# EAGLE design Escorna_CPU_2_10 (EAGLE 6.4)
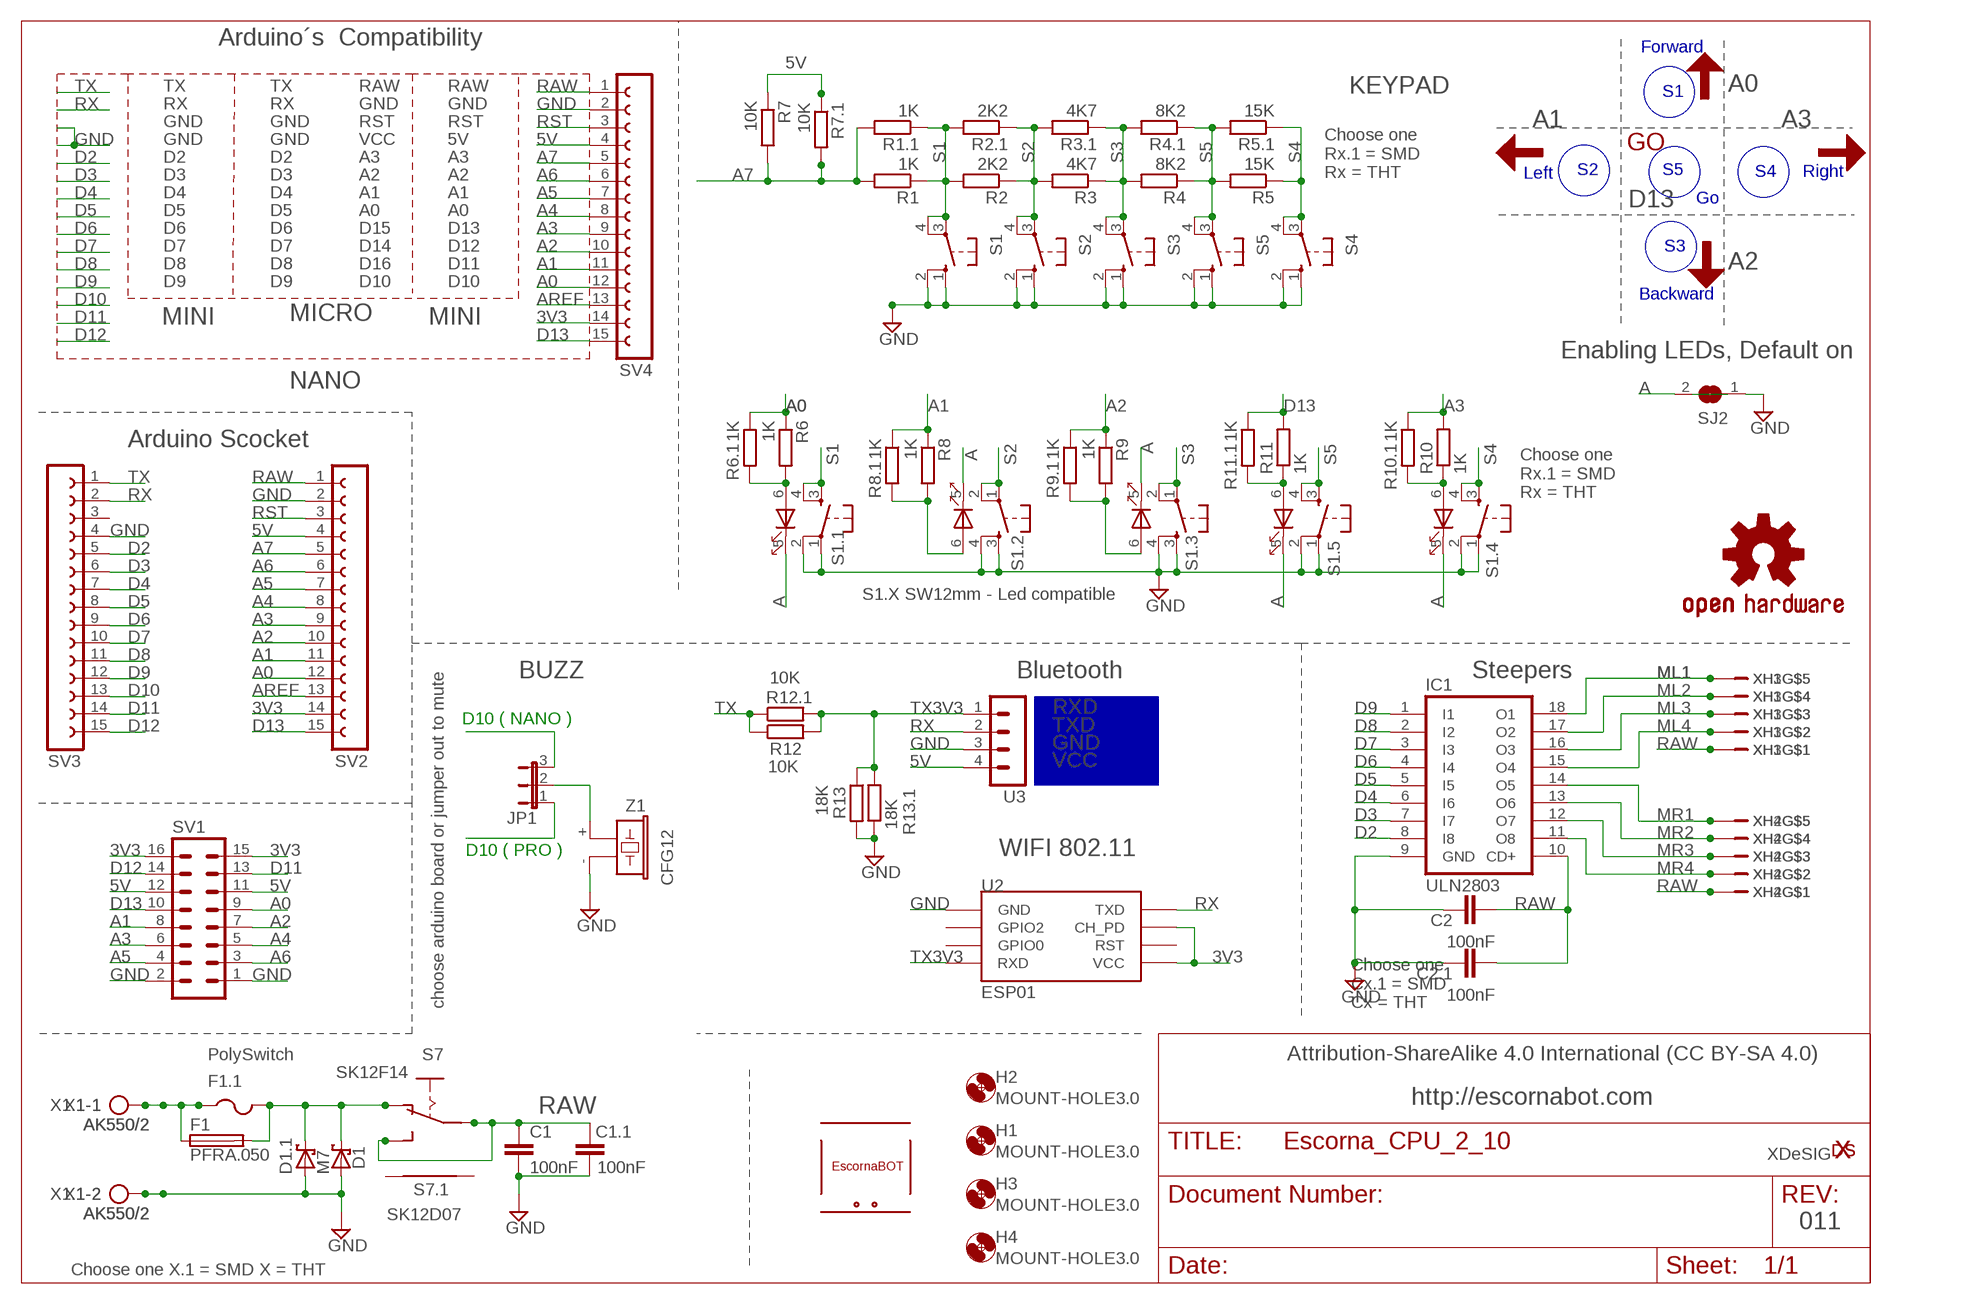
[diagram p0: schematic, sheet 1]

## Parts
C1  100nF  C-EU025-025X050  [C025-025X050]
C1.1  100nF  C-EUC1206  [C1206]
C2  100nF  C-EU025-025X050  [C025-025X050]
C2.1  100nF  C-EUC1206  [C1206]
D1  1N5817  P4KEXX  [DO41-10]
D1.1  M7  SCHOTTKY-DIODESMA  [SMA]
ESC  ESCORNABOT  [ESCORNA_PEQUE]
F1  PFRA.050  FUSETE5  [TE5]
F1.1  PolySwitch  PTCFUSE-1206  [R1206]
H1  MOUNT-HOLE3.0  [3,0]
H2  MOUNT-HOLE3.0  [3,0]
H3  MOUNT-HOLE3.0  [3,0]
H4  MOUNT-HOLE3.0  [3,0]
IC1  ULN2803  ULN2803A  [DIL18]
JP1  JUMPER_JP2E  [JUMPER_JP2]
LOGO2  OSHW-LOGOS  [OSHW-LOGO-S]
R1  1K  R-EU_0204/7  [0204/7]
R1.1  1K  R-EU_R0603  [R0603]
R2  2K2  R-EU_0204/7  [0204/7]
R2.1  2K2  R-EU_R0603  [R0603]
R3  4K7  R-EU_0204/7  [0204/7]
R3.1  4K7  R-EU_R0603  [R0603]
R4  8K2  R-EU_0204/7  [0204/7]
R4.1  8K2  R-EU_R0603  [R0603]
R5  15K  R-EU_0204/7  [0204/7]
R5.1  15K  R-EU_R0603  [R0603]
R6  1K  R-EU_0204/7  [0204/7]
R6.1  1K  R-EU_R0603  [R0603]
R7  10K  R-EU_0204/7  [0204/7]
R7.1  10K  R-EU_R0603  [R0603]
R8  1K  R-EU_0204/7  [0204/7]
R8.1  1K  R-EU_R0603  [R0603]
R9  1K  R-EU_0204/7  [0204/7]
R9.1  1K  R-EU_R0603  [R0603]
R10  1K  R-EU_0204/7  [0204/7]
R10.1  1K  R-EU_R0603  [R0603]
R11  1K  R-EU_0204/7  [0204/7]
R11.1  1K  R-EU_R0603  [R0603]
R12  10K  R-EU_0204/7  [0204/7]
R12.1  10K  R-EU_R0603  [R0603]
R13  18K  R-EU_0204/7  [0204/7]
R13.1  18K  R-EU_R0603  [R0603]
S1  10-XX  [B3F-10XX]
S1.1  B3F-9XXX  SWITCH-OMRON_B3F-9XXX  [B3F-9XXX]
S1.2  B3F-9XXX  SWITCH-OMRON_B3F-9XXX  [B3F-9XXX]
S1.3  B3F-9XXX  SWITCH-OMRON_B3F-9XXX  [B3F-9XXX]
S1.4  B3F-9XXX  SWITCH-OMRON_B3F-9XXX  [B3F-9XXX]
S1.5  B3F-9XXX  SWITCH-OMRON_B3F-9XXX  [B3F-9XXX]
S2  10-XX  [B3F-10XX]
S3  10-XX  [B3F-10XX]
S4  10-XX  [B3F-10XX]
S5  10-XX  [B3F-10XX]
S7  SK12F14  ESCORNA_SK12F14F  [ESCORNA_SK-12F14-G]
S7.1  SK12D07  ESCORNA_SK12F14D  [ESCORNA_SK-12D07]
SJ2  SJ  [SJ]
SV1  MA08-2  [MA08-2]
SV2  CON-LSTA_FE15-1  [CON-LSTA_FE15]
SV3  CON-LSTA_FE15-1  [CON-LSTA_FE15]
SV4  CON-LSTA_FE15-1  [CON-LSTA_FE15]
U2  ESP01  [ESP01]
U3  MA04-1  [MA04-1]
U$1  FRECHA  [FRECHA]
U$2  GO  [VALE]
U$3  FRECHA  [FRECHA]
U$6  FRECHA  [FRECHA]
U$11  FRECHA  [FRECHA]
U$13  XDESIG_XDESIG21  [XDESIG_XDESIG]
X1  AK550/2  [AK550/2]
X1.1  AK550/2  [AK550/2]
XDS1  XDESIG  [XDESIG_CU_2]
XH1  B5B-XH-A  [B5B-XH-A]
XH2  B5B-XH-A  [B5B-XH-A]
XH3  B5B-XH-A  [B5B-XH-A]
XH4  B5B-XH-A  [B5B-XH-A]
Z1  CFG12  F/CM12P  [F/CM12P]

## Nets
3V3: SV1.15 SV1.16 SV2.14 SV4.14 U2.CH_PD U2.VCC
5V: R7.1 R7.1.1 SV1.11 SV1.12 SV2.4 SV4.4 U3.4
A: S1.1.5(K) S1.2.5(K) S1.3.5(K) S1.4.5(K) S1.5.5(K) SJ2.2
A0: JP1.1 R6.1 R6.1.1 SV1.9 SV2.12 SV4.12
A1: R8.1 R8.1.1 SV1.8 SV2.11 SV4.11
A2: R9.1 R9.1.1 SV1.7 SV2.10 SV4.10
A3: R10.1.1 R10.2 SV1.6 SV2.9 SV4.9
A4: SV1.5 SV2.8 SV4.8
A5: SV1.4 SV2.7 SV4.7
A6: SV1.3 SV2.6 SV4.6
A7: R1.1.2 R1.2 R7.1.2 R7.2 SV2.5 SV4.5
AREF: SV2.13 SV4.13
D2: IC1.8(I8) SV3.5
D3: IC1.7(I7) SV3.6
D4: IC1.6(I6) SV3.7
D5: IC1.5(I5) SV3.8
D6: IC1.4(I4) SV3.9
D7: IC1.3(I3) SV3.10
D8: IC1.2(I2) SV3.11
D9: IC1.1(I1) SV3.12
D10: JP1.3 SV3.13
D11: SV1.13 SV3.14
D12: SV1.14 SV3.15
D13: R11.1.1 R11.2 SV1.10 SV2.15 SV4.15
GND: C1.1.1 C1.2 C2.1 C2.1.1 D1.1.A D1.A IC1.9(GND) R13.1.1 R13.2 S1.1(S) S1.1.1(P) S1.1.2(P1) S1.2(S1) S1.2.3(S) S1.2.4(S1) S1.3.3(S) S1.3.4(S1) S1.4.1(P) S1.4.2(P1) S1.5.1(P) S1.5.2(P1) S2.1(S) S2.2(S1) S3.1(S) S3.2(S1) S4.1(S) S4.2(S1) S5.1(S) S5.2(S1) SJ2.1 SV1.1 SV1.2 SV2.2 SV3.4 SV4.2 U2.GND U3.3 X1.1.2 X1.2 Z1.-
ML1: IC1.18(O1) XH1.P$5 XH3.P$5
ML2: IC1.17(O2) XH1.P$4 XH3.P$4
ML3: IC1.16(O3) XH1.P$3 XH3.P$3
ML4: IC1.15(O4) XH1.P$2 XH3.P$2
MR1: IC1.14(O5) XH2.P$5 XH4.P$5
MR2: IC1.13(O6) XH2.P$4 XH4.P$4
MR3: IC1.12(O7) XH2.P$3 XH4.P$3
MR4: IC1.11(O8) XH2.P$2 XH4.P$2
N$2: JP1.2 Z1.+
N$3: D1.1.C D1.C F1.1.2 F1.2 S7.1.P$2(O) S7.P$2(O)
N$4: R8.1.2 R8.2 S1.2.6(A)
N$5: R6.1.2 R6.2 S1.1.6(A)
N$6: R9.1.2 R9.2 S1.3.6(A)
N$8: R10.1 R10.1.2 S1.4.6(A)
N$10: S7.1.P$4 S7.P$4
N$11: S7.1.P$5 S7.P$5
N$12: F1.1 F1.1.1 X1.1 X1.1.1
N$13: R11.1 R11.1.2 S1.5.6(A)
RAW: C1.1 C1.1.2 C2.1.2 C2.2 IC1.10(CD+) S7.1.P$1(P) S7.1.P$3(S) S7.P$1(P) S7.P$3(S) SV2.1 SV4.1 XH1.P$1 XH2.P$1 XH3.P$1 XH4.P$1
RST: SV2.3 SV4.3
RX: SV3.2 U2.TX(TXD) U3.2
S1: R1.1 R1.1.1 R2.1.2 R2.2 S1.1.3(S) S1.1.4(S1) S1.3(P) S1.4(P1)
S2: R2.1 R2.1.1 R3.1.2 R3.2 S1.2.1(P) S1.2.2(P1) S2.3(P) S2.4(P1)
S3: R3.1 R3.1.1 R4.1.2 R4.2 S1.3.1(P) S1.3.2(P1) S3.3(P) S3.4(P1)
S4: R5.1 R5.1.1 S1.4.3(S) S1.4.4(S1) S4.3(P) S4.4(P1)
S5: R4.1 R4.1.1 R5.1.2 R5.2 S1.5.3(S) S1.5.4(S1) S5.3(P) S5.4(P1)
TX: R12.1 R12.1.1 SV3.1
TX3V3: R12.1.2 R12.2 R13.1 R13.1.2 U2.RX(RXD) U3.1
Unconnected: SV3.3 U2.GPIO0 U2.GPIO2 U2.RST

## Notes on the sheet
- Arduino´s  Compatibility
- Forward
- TX | TX | RAW | RAW | KEYPAD | A0
- S1
- RX | RX | GND | GND
- GND | GND | RST | RST | A1 | A3
- GND | GND | VCC | 5V
- D2 | D2 | A3 | A3
- Left | S2 | S5 | S4 | Right
- D3 | D3 | A2 | A2
- Choose one
  Rx.1 = SMD
  Rx = THT
- D4 | D4 | A1 | A1
- D13 | Go
- D5 | D5 | A0 | A0
- D6 | D6 | D15 | D13
- D7 | D7 | D14 | D12 | S3
- D8 | D8 | D16 | D11 | A2
- D9 | D9 | D10 | D10
- Backward
- MINI | MINI
- MICRO
- Enabling LEDs, Default on
- NANO
- Arduino Scocket
- Choose one
  Rx.1 = SMD
  Rx = THT
- S1.X SW12mm - Led compatible
- choose arduino board or jumper out to mute
- BUZZ | Bluetooth | Steepers
- RXD
- D10 ( NANO )
- TXD
- GND
- VCC
- D10 ( PRO ) | WIFI 802.11
- Choose one
  Cx.1 = SMD
  Cx = THT
- Attribution-ShareAlike 4.0 International (CC BY-SA 4.0)
- http://escornabot.com
- XDeSIG
- 011
- Choose one X.1 = SMD X = THT

## Library data of the parts
C1 C1.1 C2 C2.1 = rcl:C-EU: CAPACITOR, European symbol
D1 = diode:P4KEXX: DIODE transient-voltage suppressor
D1.1 = diode:SCHOTTKY-DIODE: Schottky Diode
ESC = escorna:ESCORNABOT
F1 = fuse:FUSE: Fuse; OC_FARNELL: unknown; OC_NEWARK: unknown
F1.1 = adafruit:PTCFUSE: PTC fuses, resettable thermistors
H1-H4 = holes:MOUNT-HOLE: MOUNTING HOLE with drill center marker
IC1 = uln-udn:ULN2803A: DRIVER ARRAY
JP1 = escorna_LBREscorna_CPU_2_10:JUMPER_JP2E: JUMPER
LOGO2 = SparkFun-Aesthetics:OSHW-LOGO: Open Source Hardware Logo This logo indicates the piece of hardware it is found on incorporates a OSHW license and/or adheres to the definition of open source hardware found here: http://freedomdefined.org/OSHW
R1 R1.1 R2 R2.1 R3 R3.1 R4 R4.1 R5 R5.1 R6 R6.1 R7 R7.1 R8 R8.1 R9 R9.1 R10 R10.1 R11 R11.1 R12 R12.1 R13 R13.1 = rcl:R-EU_: RESISTOR, European symbol
S1-S5 = switch-omron:10-XX: OMRON SWITCH; MPN: B3F-1000; OC_FARNELL: 176432; OC_NEWARK: 36M3542
S1.1-S1.5 = Escorna_CPU_2_01:SWITCH-OMRON_B3F-9XXX
S7 S7.1 = escorna_ELIB:ESCORNA_SK12F14
SJ2 = jumper:SJ: SMD solder JUMPER
SV1 = con-lstb:MA08-2: PIN HEADER; OC_FARNELL: unknown; OC_NEWARK: unknown
SV2-SV4 = escorna_LBREscorna_CPU_2_10:CON-LSTA_FE15-1: FEMALE HEADER; OC_FARNELL: unknown; OC_NEWARK: unknown
U2 = esp8266modules:ESP01: ESP8266 Wifi module 01
U3 = con-lstb:MA04-1: PIN HEADER; OC_FARNELL: unknown; OC_NEWARK: unknown
U$1 U$3 U$6 U$11 = escorna:FRECHA
U$2 = escorna:GO
U$13 = Escorna_CPU_2_01:XDESIG_XDESIG
X1 X1.1 = con-ptr500:AK550/2: CONNECTOR; OC_FARNELL: unknown; OC_NEWARK: unknown
XDS1 = xdesig:XDESIG
XH1-XH4 = con-jst:B5B-XH-A
Z1 = buzzer:F/CM12P: BUZZER Source: Buerklin; OC_FARNELL: unknown; OC_NEWARK: unknown

## Net classes
0 default: width 0.254 mm, drill 0.61 mm, clearance 0.254 mm
1 power: width 0.254 mm, drill 0.61 mm, clearance 0.254 mm

## Board
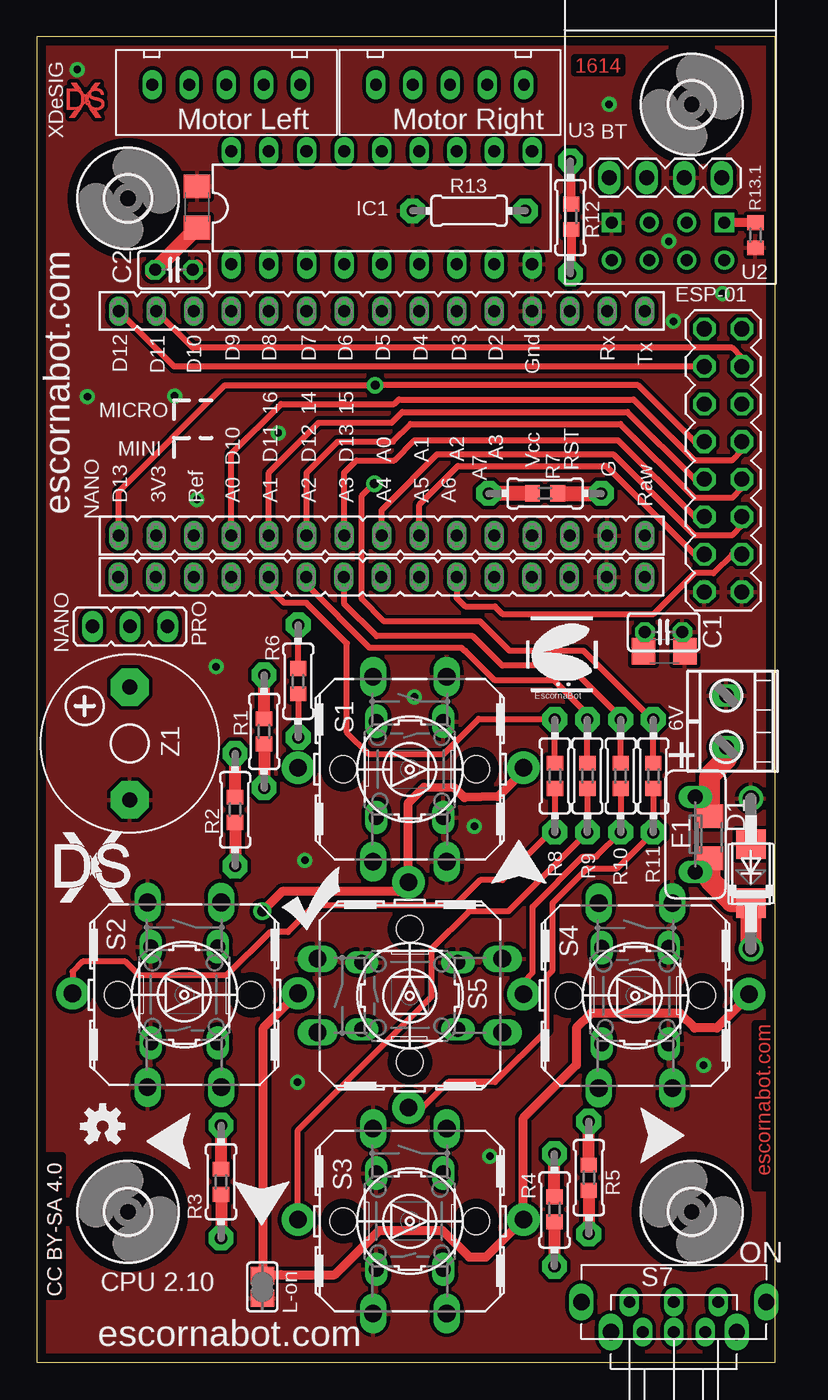
[diagram p1: board, top side]
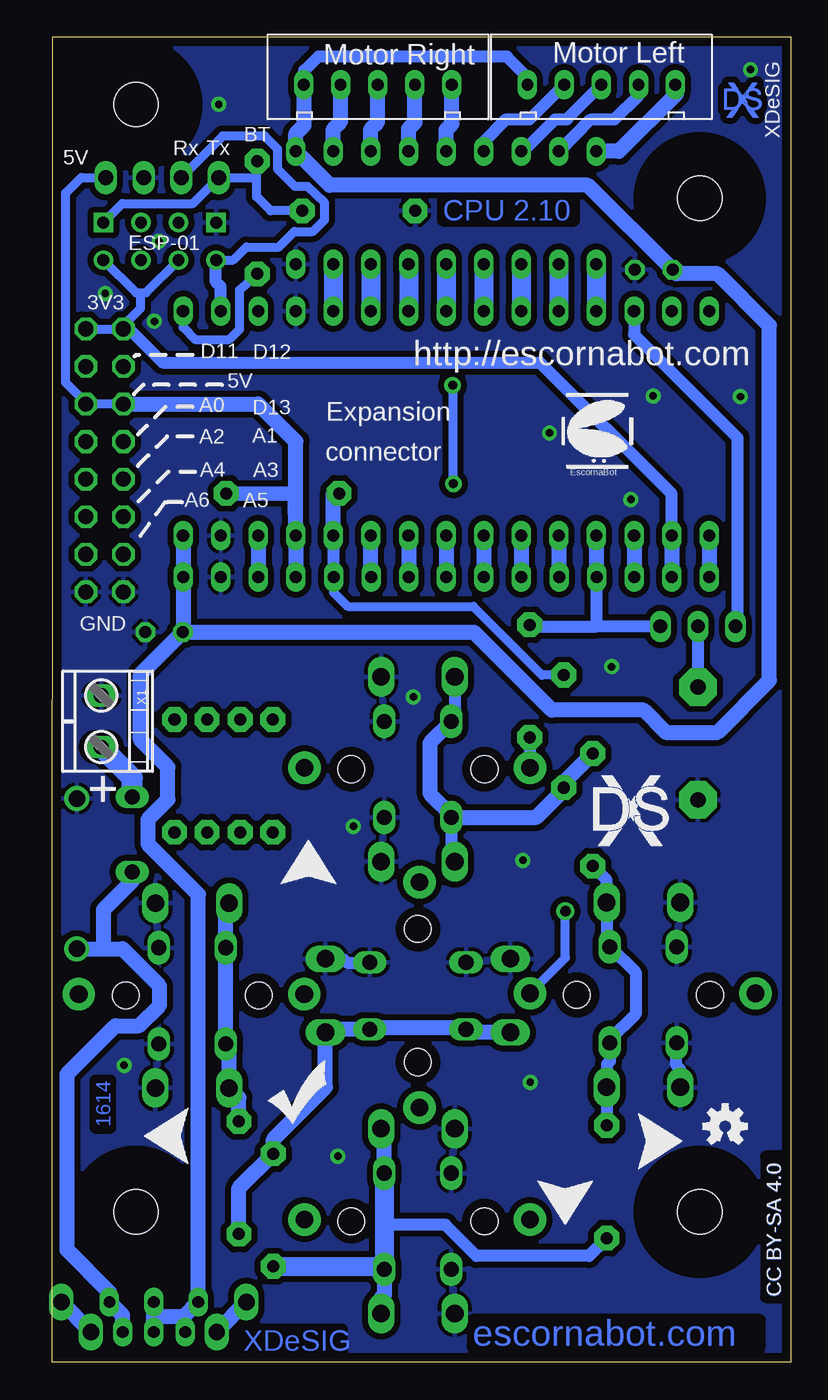
[diagram p2: board, bottom side, seen from below]

Size 49.91 x 89.59 mm. Coordinates in mm from the lower left corner, seen from the top.
Outline: 49.91,0 49.89,89.59 0,89.59 0,0 49.91,0
Copper layers (1*16): Top 0.035mm / dielectric 1.5mm / Bottom 0.035mm
Design rules "default": minimum track width 10mil, minimum drill 22mil, track to track 10mil, track to pad 10mil, pad to pad 8mil, via to via 12mil, smd to smd 8mil, copper to edge 24mil, drill to drill 12mil, minimum pad ring 10mil, minimum via ring 10mil, stop-mask expansion 2mil, vias tented up to drill 30mil, thermal gap 10mil

### Footprints (pad centres in the part's own frame; a part is rotated, then mirrored left to right if it is on the bottom)
C025-025X050 = drill 0.813 octagon: 1 -1.27,0; 2 1.27,0
C1206 = smd 1.6 x 1.8: 1 -1.4,0; 2 1.4,0
DO41-10 = drill 1.118: A 5.08,0; C -5.08,0
SMA = smd 2 x 2: A 2,0; C -2,0
TE5 = drill 1.016 long: 1 -2.54,0; 2 2.54,0
R1206 = smd 1.6 x 1.803: 1 -1.422,0; 2 1.422,0
3,0 = hole 3: 0,0
DIL18 = drill 0.813 long: 1 -10.16,-3.81; 2 -7.62,-3.81; 3 -5.08,-3.81; 4 -2.54,-3.81; 5 0,-3.81; 6 2.54,-3.81; 7 5.08,-3.81; 8 7.62,-3.81; 9 10.16,-3.81; 10 10.16,3.81; 11 7.62,3.81; 12 5.08,3.81; 13 2.54,3.81; 14 0,3.81; 15 -2.54,3.81; 16 -5.08,3.81; 17 -7.62,3.81; 18 -10.16,3.81
JUMPER_JP2 = drill 0.914 long: 1 -2.54,0; 2 0,0; 3 2.54,0
0204/7 = drill 0.813 pad 1.676 octagon: 1 -3.81,0; 2 3.81,0
R0603 = smd 1 x 1.1: 1 -0.85,0; 2 0.85,0
B3F-10XX = drill 1.016 long: 1 -3.251,2.261; 2 3.251,2.261; 3 -3.251,-2.261; 4 3.251,-2.261
B3F-9XXX = drill 1.194 long: 1 -6.248,2.489; 2 6.248,2.489; 3 -6.248,-2.489; 4 6.248,-2.489 | drill 1.194 pad 2.184: 5 -0.102,7.671; 6 -0.102,-7.569 | hole 1.803: 0,-4.496; 0,4.496
ESCORNA_SK-12F14-G = drill 0.8 long: P$1 0,0; P$2 3,0; P$3 -3,0 | drill 1.1 long: P$4 -6.25,0; P$5 6.25,0
ESCORNA_SK-12D07 = drill 0.8 long: P$1 0,0; P$2 2.115,0; P$3 -2.115,0 | drill 1.1 pad 1.27 long: P$4 -4.25,0; P$5 4.25,0
SJ = smd 1.168 x 1.6: 1 -0.762,0; 2 0.762,0
MA08-2 = drill 1.016 octagon: 1 -8.89,-1.27; 2 -8.89,1.27; 3 -6.35,-1.27; 4 -6.35,1.27; 5 -3.81,-1.27; 6 -3.81,1.27; 7 -1.27,-1.27; 8 -1.27,1.27; 9 1.27,-1.27; 10 1.27,1.27; 11 3.81,-1.27; 12 3.81,1.27; 13 6.35,-1.27; 14 6.35,1.27; 15 8.89,-1.27; 16 8.89,1.27
CON-LSTA_FE15 = drill 0.813 long: 1 -17.78,0; 2 -15.24,0; 3 -12.7,0; 4 -10.16,0; 5 -7.62,0; 6 -5.08,0; 7 -2.54,0; 8 0,0; 9 2.54,0; 10 5.08,0; 11 7.62,0; 12 10.16,0; 13 12.7,0; 14 15.24,0; 15 17.78,0
ESP01 = drill 0.8: CH_PD -1.285,-8.178; GPIO0 1.255,-5.638; GPIO2 -1.285,-5.638; RST 1.255,-8.178; TX -3.825,-8.178; VCC 3.795,-8.178 | drill 0.8 square: GND -3.825,-5.638; RX 3.795,-5.638
MA04-1 = drill 1.016 long: 1 -3.81,0; 2 -1.27,0; 3 1.27,0; 4 3.81,0
AK550/2 = drill 1 pad 1.5 long: 1 -1.75,0; 2 1.75,0
B5B-XH-A = drill 0.8 long: P$1 -5.17,-0.19; P$2 -2.69,-0.175; P$3 -0.175,-0.175; P$4 2.34,-0.175; P$5 4.83,-0.175
F/CM12P = drill 1.016 pad 2.54 octagon: + 3.81,0; - -3.81,0

### Placement (x,y rotation side)
C1  42.35,49.35 0 top
C1.1  42.39,48.06 180 top
C2  9.26,73.85 180 top
C2.1  10.82,78.09 270 top
D1  48.25,33.02 90 top
D1.1  48.25,33.02 90 top
ESC  15.55,60.36 0 bottom
F1  44.5,35.68 270 top
F1.1  45.47,35.49 270 top
H1  44.25,10.16 90 top
H2  6.15,10.16 90 top
H3  44.25,85.03 0 top
H4  6.15,78.68 0 top
IC1  23.29,78.04 0 top
JP1  6.28,49.73 180 top
LOGO1  OSHW-LOGOS  [OSHW-LOGO-S]  4.44,15.94 0 top
LOGO2  4.44,15.94 0 bottom
R1  15.35,42.64 90 top
R1.1  15.35,42.64 90 top
R2  13.39,37.34 90 top
R2.1  13.39,37.34 90 top
R3  12.44,12.19 90 top
R3.1  12.44,12.19 90 top
R4  34.97,10.28 270 top
R4.1  34.97,10.33 270 top
R5  37.3,12.47 270 top
R5.1  37.3,12.47 270 top
R6  17.65,46.03 270 top
R6.1  17.65,46.03 270 top
R7  34.34,58.73 180 top
R7.1  34.34,58.73 180 top
R8  35,39.63 270 top
R8.1  35,39.63 270 top
R9  37.2,39.63 270 top
R9.1  37.2,39.63 270 top
R10  39.45,39.63 90 top
R10.1  39.45,39.63 270 top
R11  41.65,39.63 90 top
R11.1  41.65,39.63 270 top
R12  36.05,77.38 90 top
R12.1  36.1,77.43 90 top
R13  29.2,77.83 180 top
R13.1  48.55,76.18 90 top
S1  25.2,40.07 270 top
S1.1  25.2,40.08 270 top
S1.2  9.96,24.83 270 top
S1.3  25.2,9.53 270 top
S1.4  40.45,24.78 270 top
S1.5  25.2,24.78 0 top
S2  9.96,24.83 90 top
S3  25.2,9.53 90 top
S4  40.44,24.76 270 top
S5  25.2,24.76 0 top
S7  43.04,4.06 0 top
S7.1  43.04,2.03 0 top
SJ2  15.23,5.08 90 top
SV1  46.37,60.96 90 top
SV2  23.29,55.88 180 top
SV3  23.29,71.06 180 top
SV4  23.28,53.08 180 top
U2  42.66,82.68 0 top
U3  42.47,80.07 0 top
U$1  40.69,17.21 180 bottom
U$2  35.38,16.08 0 bottom
U$3  10.34,13.01 0 bottom
U$4  FRECHA  [FRECHA]  13.26,12.24 270 top
U$5  ESCORNABOT  [ESCORNA_PEQUE]  33,45.25 0 top
U$6  17.17,12.29 270 bottom
U$7  FRECHA  [FRECHA]  40.76,13.4 0 top
U$8  FRECHA  [FRECHA]  34.49,32.31 90 top
U$9  FRECHA  [FRECHA]  10.39,16.85 180 top
U$10  GO  [VALE]  16.5,29.15 0 top
U$11  30.67,32.29 90 bottom
U$12  XDESIG_XDESIG21  [XDESIG_XDESIG]  1.23,31.07 0 top
U$13  13.33,34.92 0 bottom
X1  46.59,43.32 90 bottom
X1.1  46.59,43.32 90 top
XDS  XDESIG  [XDESIG_CU_2]  2.02,84.14 0 top
XDS1  4.5,84.14 0 bottom
XH1  12.63,86.55 0 bottom
XH2  27.74,86.55 0 bottom
XH3  12.63,86.17 180 top
XH4  27.74,86.17 180 top
Z1  6.27,41.82 90 top

### Tracks (layer width: path | path; a pad name or v marks a point on that pad's centre or on a via)
3V3
  Bottom 0.61: 46.54,74.61 U2.VCC | U2.VCC 46.46,74.82 | U2.VCC 44.25,72.29 43.87,72.29 | 43.87,72.29 43.59,72.29 U2.CH_PD | 43.87,72.29 43.93,72.23 43.93,71.25 45.1,70.08 SV1.16 SV1.15
  Bottom 0.813: SV2.14 8.05,58.68 16.95,67.58 42.45,67.58 44.72,69.85 SV1.16
  Bottom 1.016: SV2.14 8.05,53.09 SV4.14
5V
  Top 1.016: R7.1.1 R7.1
  Bottom 0.61: SV1.12 SV1.11 47.64,64.87 49,66.23 49,79.03 47.95,80.08 U3.4
  Bottom 1.016: SV2.4 33.46,53.09 SV4.4 | SV1.12 35.99,64.77 33.46,62.23 SV2.4 | SV2.4 33.5,58.68 R7.1
A  (via drill 0.7)
  Top 0.254: SJ2.2 16.44,5.84 16.5,5.91
  Top 0.406: 32.82,9.68 S1.3.5
  Top 0.61: 25.06,32.44 25.1,32.44 25.1,37.81 26.15,38.86 28.25,38.8 28.88,38.16 31.17,38.23 32.87,39.93 S1.1.5 | 25.06,32.44 24.44,31.81 16.56,31.81 v15.23,30.48 | S1.2.5 15.29,22.59 15.29,5.91 16.5,5.91 20.12,5.91 23.1,8.89 27.42,8.89 29.2,7.11 30.36,7.11 S1.3.5 32.87,16.5 36.45,20.08 36.45,22.58 37.45,23.58 43.45,23.58 44.45,22.58 45.95,22.58 48.11,24.74 48.11,24.87 S1.4.5 | S1.5.5 25.07,32.45 25.06,32.44
  Bottom 0.61: S1.2.5 15.23,27.33 v15.23,30.48
A0
  Top 0.406: SV1.9 47.64,61.62 46.98,60.96 44.44,60.96 40.32,65.08 24.45,65.08 24.14,64.77 16.5,64.77 13.13,61.41 SV2.12 | R6.1.1 R6.1
  Bottom 0.813: JP1.1 13.1,49.73 | R6.1 17.54,49.73 13.1,49.73 | 13.1,49.73 13.1,53.06 SV4.12
  Bottom 1.016: SV2.12 13.13,53.09 SV4.12
A1
  Top 0.406: SV1.8 44.44,59.69 39.9,64.23 24.7,64.23 23.97,63.5 19.04,63.5 15.67,60.13 SV2.11 | SV4.11 15.66,52.38 16.71,51.33 18.2,51.33 20.95,48.58 20.95,42.58 22.45,41.08 27.45,41.08 29.85,43.48 34.96,43.48 R8.1 R8.1.1
  Bottom 1.016: SV2.11 15.67,53.09 SV4.11
A2
  Top 0.406: SV1.7 47.64,59.08 46.98,58.42 44.44,58.42 39.43,63.43 25.25,63.43 24.05,62.23 20.31,62.23 18.21,60.13 SV2.10 | R9.1.1 R9.1 37.2,43.83 34.95,46.08 30.95,46.08 28.95,48.08 28.9,48.08 28.7,48.28 22.5,48.28 18.25,52.53 18.25,53.03 SV4.10
  Bottom 1.016: SV2.10 18.21,53.09 SV4.10
A3
  Top 0.406: SV1.6 44.44,57.15 39.26,62.33 25.5,62.33 24.13,60.96 21.58,60.96 20.75,60.13 SV2.9 | SV4.9 20.74,51.29 22.95,49.08 29.45,49.08 31.45,47.08 35.95,47.08 39.45,43.58 R10.2 R10.1.1
  Bottom 1.016: SV2.9 20.75,53.09 SV4.9
A4
  Top 0.406: SV1.5 47.64,56.54 46.98,55.88 44.44,55.88 38.94,61.38 27.05,61.38 25.39,59.72 25.39,59.69 23.29,57.59 SV2.8
  Bottom 1.016: SV2.8 23.29,53.09 SV4.8
A5
  Top 0.406: SV1.4 44.44,54.61 38.47,60.58 28.45,60.58 25.83,57.96 SV2.7
  Bottom 1.016: SV2.7 25.83,53.09 SV4.7
A6
  Top 0.406: SV1.3 46.98,54.61 45.71,53.34 44.44,53.34 41.68,50.58 31.45,50.58 30.95,51.08 28.95,51.08 28.36,51.67 SV4.6 28.37,53.09
  Bottom 1.016: SV4.6 28.37,53.09 SV2.6
A7
  Top 0.813: R1.1.2 R1.2
  Top 1.016: R7.1.2 R7.2
  Bottom 0.406: 30.91,53.14 30.91,53.09 SV4.5
  Bottom 0.61: SV4.5 30.9,52.03 29.95,51.08 21.45,51.08 16.82,46.45 R1.2
  Bottom 0.813: SV2.5 30.91,53.14
  Bottom 1.016: SV2.5 30.91,58.73 R7.2
AREF
  Bottom 1.016: SV2.13 10.59,53.09 SV4.13
D2
  Bottom 1.27: IC1.8 SV3.5
D3
  Bottom 1.27: IC1.7 SV3.6
D4
  Bottom 1.27: IC1.6 SV3.7
D5
  Bottom 1.27: IC1.5 SV3.8
D6
  Bottom 1.27: IC1.4 SV3.9
D7
  Bottom 1.27: IC1.3 SV3.10
D8
  Bottom 1.27: IC1.2 SV3.11
D9
  Bottom 1.27: IC1.1 SV3.12
D10
  Bottom 0.813: JP1.3 3.6,50.17 3.6,62.48 10.59,69.47 SV3.13
D11
  Top 0.406: SV1.13 47.64,67.92 46.98,68.58 10.53,68.58 SV3.14
D12
  Top 0.406: SV3.15 9.26,67.31 SV1.14
D13  (via drill 0.6)
  Top 0.406: SV2.15 5.51,58.86 12.69,66.04 v22.85,66.04 40.63,66.04 44.44,62.23 SV1.10 | v22.8,59.38 22.5,59.08 22.45,59.08 21.95,58.58 21.95,51.58 23.45,50.08 29.95,50.08 31.95,48.08 36.95,48.08 41.59,43.44 R11.2 R11.1.1
  Bottom 0.61: v22.85,66.04 22.85,59.43 v22.8,59.38
  Bottom 1.016: SV2.15 5.51,53.09 SV4.15
GND  (via drill 0.5 pad 0.25)
  Top 0.813: 10.81,74.13 C2.1
  Bottom 0.254: S4.2 43.17,21.59 42.6,21.41
  Bottom 0.61: IC1.9 33.71,74.23
  Bottom 0.813: 7.47,19.8 7.74,20.07 7.74,21.54 S2.1 | 7.74,28.12 S2.2 | 30.23,27.25 29.96,26.99 28.49,26.99 S5.2
  Bottom 1.016: 42.8,28.24 S4.1
  other vias: 38.66,85.03 43.01,70.37 2.72,87.38 42.7,75.77 46.33,72.24 18.11,33.92 10.81,58.32 9.31,65.32 3.41,65.27 16.31,62.82 12.11,47.02 17.61,18.92 25.51,44.97 29.56,36.22 45.06,20.07 30.61,13.92
  pour Bottom (isolate 0.406): -0.05,90.08 49.95,90.08 49.95,-0.42 -0.05,-0.42
  pour Top: -0.55,90.58 50.45,90.58 50.45,-1.42 -0.55,-1.42
ML1
  Bottom 0.406: XH1.P$5 XH3.P$5
  Bottom 1.016: XH1.P$5 7.73,85.73 11.61,81.85 IC1.18
ML2
  Bottom 0.813: IC1.17 15.61,81.85 13.52,84.01 11.92,84.01 10.3,85.63 XH3.P$4
  Bottom 1.016: XH3.P$4 XH1.P$4
ML3
  Bottom 0.813: IC1.16 18.09,81.85 15.93,84.01 15.13,84.01 XH3.P$3
  Bottom 1.016: XH3.P$3 XH1.P$3
ML4
  Bottom 0.813: IC1.15 20.75,82.49 19.23,84.01 17.65,84.01 XH3.P$2
  Bottom 1.016: XH3.P$2 XH1.P$2
MR1
  Bottom 1.016: IC1.14 23.29,83.31 22.91,83.7 XH4.P$5 XH2.P$5
MR2
  Bottom 1.016: IC1.13 25.83,83.38 25.39,83.82 25.4,83.83 XH4.P$4 XH2.P$4
MR3
  Bottom 1.016: IC1.12 28.37,83.38 27.91,83.83 XH4.P$3 XH2.P$3
MR4
  Bottom 1.016: IC1.11 30.91,83.38 30.43,83.86 XH4.P$2 XH2.P$2
N$1
  Top 0.254: 15.2,5.83 15.2,4.23
N$2
  Bottom 0.813: JP1.2 Z1.+
N$3
  Top 1.422: D1.C D1.1.C 48.14,31.13 46.95,31.13 45.47,32.61 F1.1.2
  Bottom 1.016: S7.1.P$2 45.16,3.18 S7.P$2 46.04,4.72 48.9,7.58 48.9,19.48 45.65,22.73 44.05,22.73 42.65,24.13 42.65,25.43 45.16,27.94 46.45,27.94 | D1.C 46.45,27.94 | F1.2 44.5,32.53 46.45,30.58 46.45,27.94
N$4
  Top 0.406: S1.2.6 2.4,26.38 3.1,27.08 5.95,27.08 6.9,26.13 12.8,26.13 15.75,29.08 16.95,29.08 18.75,30.88 28.25,30.88 29.95,32.58 31.45,32.58 34.69,35.82 R8.2 R8.1.2
N$5
  Top 0.406: R6.1.2 R6.2
  Bottom 0.813: R6.2 17.65,40.2 S1.1.6
N$6
  Top 0.406: S1.3.6 17.63,15.67 26.66,24.7 26.66,27.94 29.2,30.48 31.86,30.48 R9.2 R9.1.2
N$8
  Top 0.406: S1.4.6 32.88,25.71 33.5,26.33 33.5,30.78 36.9,34.18 37.81,34.18 R10.1 R10.1.2
N$10
  Bottom 1.016: S7.1.P$4 38.79,2.06 S7.P$4
N$11
  Bottom 1.016: S7.1.P$5 47.29,2.06 S7.P$5
N$12
  Top 1.422: F1.1.1 45.47,39.66 46.59,40.78 X1.1.1
  Bottom 1.422: F1.1 44.5,39.48 X1.1.1
N$13
  Top 0.406: S1.5.6 26.08,17.21 27.8,18.93 30.95,18.93 34.45,22.43 34.45,26.08 34.85,26.48 34.85,31.03 37.2,33.38 39.21,33.38 R11.1 R11.1.2
RAW
  Top 0.813: C2.2 8.09,73.85
  Top 1.016: C1.1.2 40.99,49.26 C1.1 | C2.1.2 7.79,73.65 C2.2
  Bottom 0.813: XH4.P$1 32.88,85.88 32.88,87.31 31.93,88.27 19.19,88.27 17.73,86.81 17.73,86.42 XH3.P$1
  Bottom 1.016: 41,3.11 S7.P$3 40.04,31.62 43.45,35.03 43.45,36.68 42.1,38.03 42.1,40.23 43.95,42.08 43.95,46.48 C1.1 | 41,3.11 43.04,3.11 S7.P$1 S7.1.P$1 | S7.1.P$3 41,2.03 41,3.11 | SV2.1 41.07,53.09 SV4.1 41.06,49.37 C1.1 | XH3.P$1 | XH4.P$1 32.91,83.6 33.46,83.06 IC1.10 31.17,79.57 13.71,79.57 C2.2 7.72,73.58 4.95,73.58 1.45,70.08 1.45,46.08 4.95,42.58 8.45,42.58 9.95,44.08 16.15,44.08 21.42,49.35 C1.1
RST
  Bottom 1.016: SV2.3 35.99,53.09 SV4.3
RX
  Bottom 0.61: U2.TX 37.68,74.5 36.8,75.38 34.6,75.38 33.55,76.43 32.3,76.43 31.5,77.23 31.5,78.38 32.65,79.48 33.5,79.48 34.7,80.68 34.7,82.03 35.55,82.88 38.4,82.88 U3.2
  Bottom 0.813: SV3.2 38.53,72.71 38.85,73.02 38.85,74.48 U2.TX
S1
  Top 0.813: R1.1.1 R1.1 | R2.1.2 R2.2
  Bottom 0.254: 22.85,36.83 S1.4
  Bottom 0.61: 22.71,46.32 S1.1.3 | S1.1.4
  Bottom 0.813: 22.71,46.32 22.71,43.55 S1.3 | S1.4 22.94,34.05 S1.1.4
  Bottom 1.016: R2.2 15.35,39.19 R1.1 15.35,38.68 17.2,36.83 22.85,36.83 22.85,36.88 24.35,38.38 24.35,41.91 S1.3
S2
  Top 0.813: R2.1.1 R2.1 | R3.1.2 R3.2
  Bottom 0.254: 12.69,19.05 12.44,19.05
  Bottom 0.813: 12.44,18.58 12.44,19.05 12.44,20.13 12.22,20.34 S2.3 12.22,21.81 10.45,23.58 10.45,26.31 S2.4 12.45,28.31 S1.2.1 12.45,32.59 R2.1 | 12.44,18.58 R3.2 | S1.2.2 12.44,18.58 | 12.44,18.58
S3
  Top 0.813: R3.1.1 R3.1 | R4.1.2 R4.2
  Bottom 0.813: R3.1 13.64,7.18 21.25,7.18 23.35,9.28 27.41,9.28 27.46,9.23 | 27.41,9.48 27.46,9.53
  Bottom 1.016: S3.4 27.46,15.54 S1.3.1 | S1.3.2 27.69,4.34 27.45,4.58 S3.3
  Bottom 1.27: S3.4 27.46,9.53 27.46,9.23 S3.3 | R4.2 27.66,6.47 S3.3 | 27.69,6.04 S3.3
S4
  Top 0.813: R5.1.1 R5.1
  Bottom 1.016: R5.1 37.3,17.87 S1.4.4 37.96,21.3 S4.4 S4.3 | S4.3 38.18,30.81 S1.4.3 | 38.35,27.84 S4.3
S5
  Top 0.813: R4.1.1 R4.1 | R5.1.2 R5.2
  Bottom 1.016: S1.5.3 21.73,22.29 S5.3 21.95,22.58 28.38,22.58 S5.4 31.23,22.5 S1.5.4 31.45,18.58 34.98,15.06 R4.1 37.3,11.77 R5.2
TX
  Top 0.61: R12.1.1 36.1,73.62 R12.1
  Bottom 0.61: SV3.1 41.07,69.95 40.25,69.13 37.95,69.13 37.25,69.83 37.25,72.47 R12.1
TX3V3
  Top 0.406: R12.1.2 36.1,78.23
  Top 0.61: R13.1.2 U2.RX | R12.1.2 36.1,81.14 R12.2
  Bottom 0.61: U2.RX 45.17,78.33 40.41,78.33 U3.1 36.12,80.07 36.11,80.08 36.11,81.23 R12.2 36.1,81.14 36.1,78.78 35.15,77.83 R13.1

### Text on the board
Top: 1614 | escornabot.com | CC BY-SA 4.0
Bottom: CPU 2.10 | 1614 | CC BY-SA 4.0 | escornabot.com | XDeSIG
tPlace: Motor Left | Motor Right | BT | XDeSIG | escornabot.com | ESP-01 | Tx | D9 | D8 | D7 | D6 | D5 | D4 | D3 | D2 | Rx | D12 | D11 | D10 | Gnd | MICRO | 16 | 14 | 15 | MINI | NANO | D10 | D11 | D12 | D13 | A0 | A1 | A2 | A3 | A7 | Vcc | RST | G | D13 | 3V3 | Ref | A0 | A1 | A2 | A3 | A4 | A5 | A6 | Raw | NANO | PRO | 6V | + | ON | CPU 2.10 | CC BY-SA 4.0 | L-on | escornabot.com
bPlace: Motor Left | Motor Right | XDeSIG | Tx | Rx | BT | 5V | ESP-01 | 3V3 | http://escornabot.com | D12 | D11 | 5V | Expansion | D13 | A0 | A1 | A2 | connector | A3 | A4 | A5 | A6 | GND | + | CC BY-SA 4.0
Measures: Attribution-ShareAlike 4.0 International (CC BY-SA 4.0)
tDocu: Attribution-ShareAlike 4.0 International (CC BY-SA 4.0)